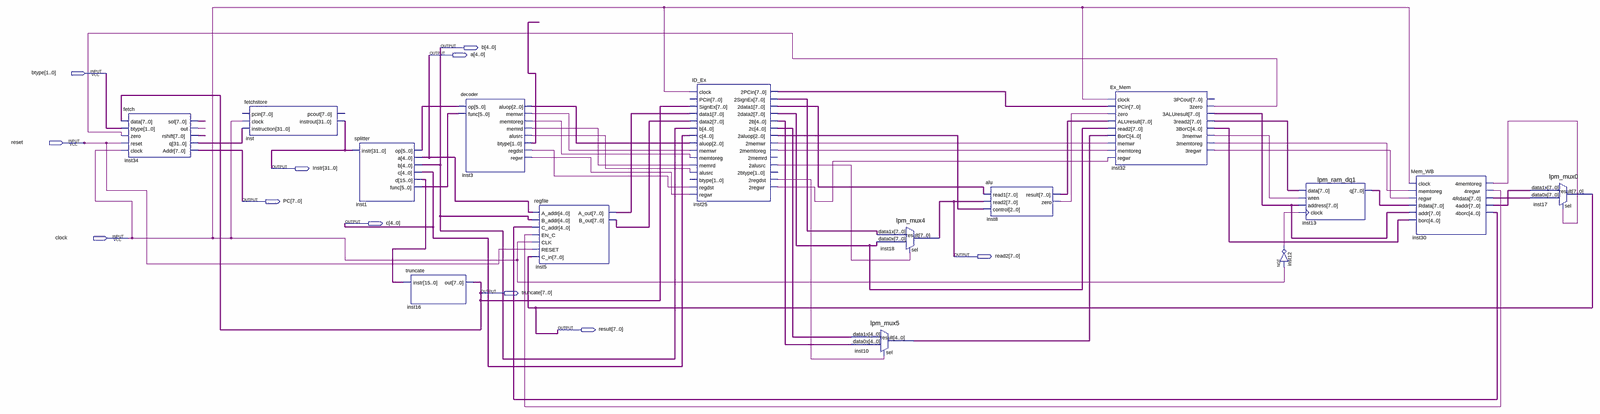
[diagram p0: schematic sheet, whole]
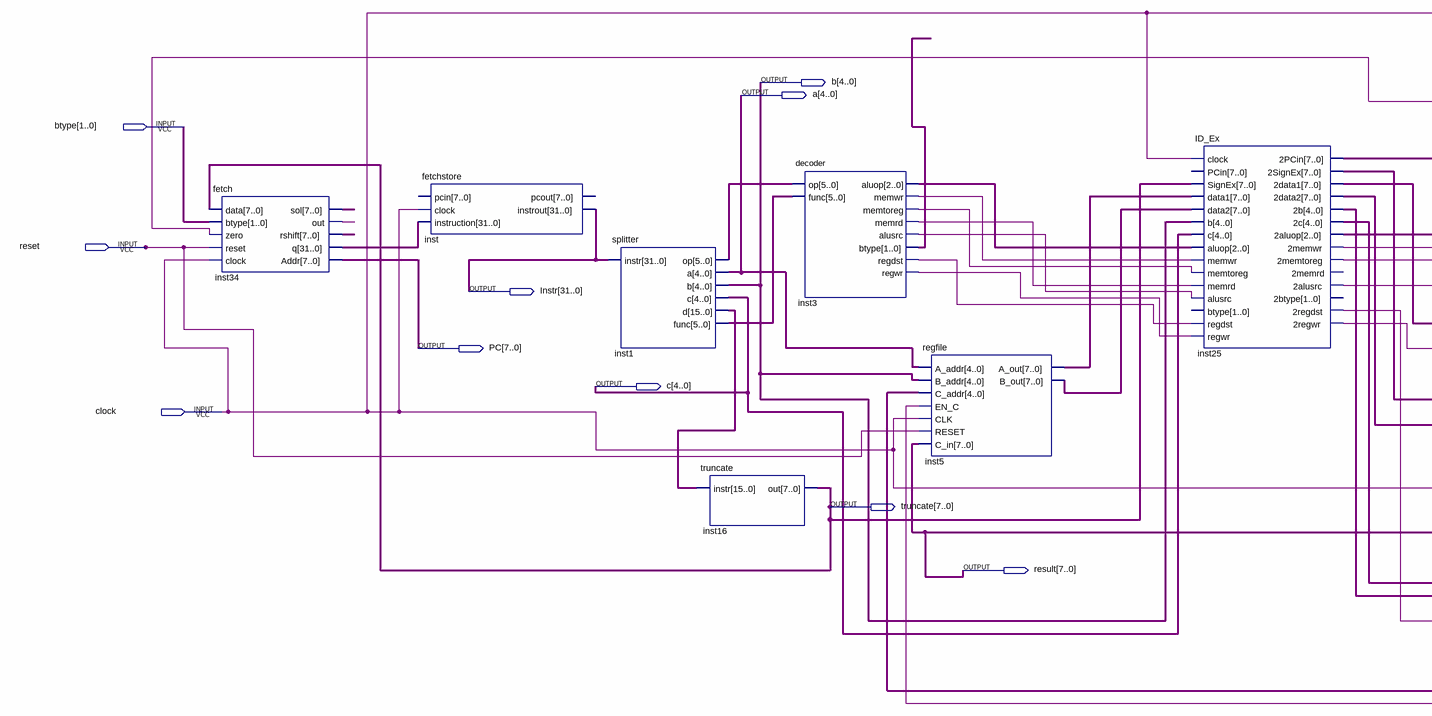
[diagram p1: schematic sheet, left part]
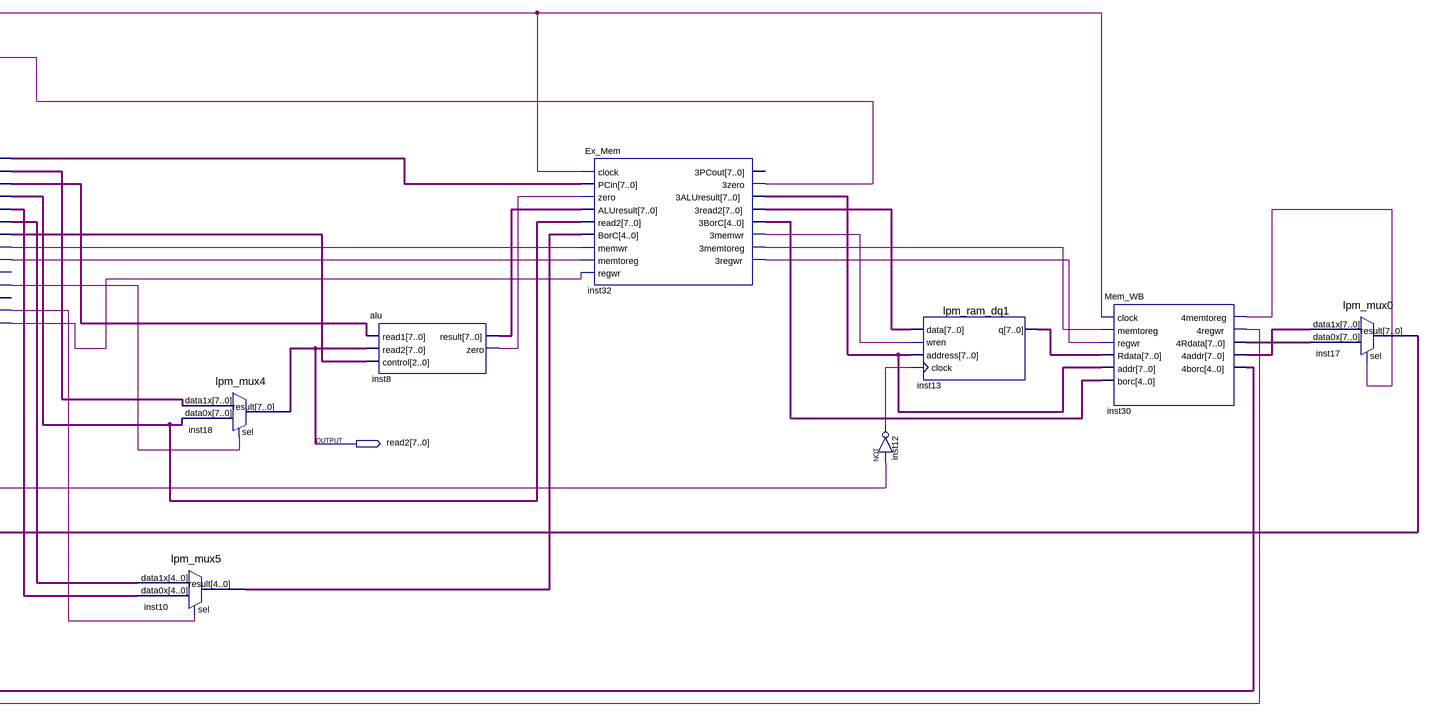
[diagram p2: schematic sheet, right part]
// Quartus schematic Project1.bdf as structural Verilog: 15 symbols, 11 pins
module Project1 (
  input  [1:0] btype,
  input  reset,
  input  clock,
  output [4:0] b,
  output [4:0] a,
  output [31:0] Instr,
  output [7:0] PC,
  output [4:0] c,
  output [7:0] read2,
  output [7:0] truncate,
  output [7:0] result
);

  wire inst3_alusrc, inst3_memrd, inst3_memtoreg, inst3_memwr, inst3_regdst, inst3_regwr, inst8_zero,
       inst12_out, inst25_2alusrc, inst25_2memtoreg, inst25_2memwr, inst25_2regdst, inst25_2regwr,
       inst30_4memtoreg, inst30_4regwr, inst32_3memtoreg, inst32_3memwr, inst32_3regwr, inst32_3zero,
       inst34_out;
  wire [1:0] inst3_btype;
  wire [2:0] inst3_aluop, inst25_2aluop;
  wire [4:0] inst10_result, inst25_2b, inst25_2c, inst30_4borc, inst32_3borc;
  wire [5:0] inst1_func, inst1_op;
  wire [7:0] inst5_a_out, inst5_b_out, inst8_result, inst13_q, inst25_2data1, inst25_2data2, inst25_2pcin,
       inst25_2signex, inst30_4addr, inst30_4rdata, inst32_3aluresult, inst32_3read2, inst34_rshift,
       inst34_sol;
  wire [15:0] inst1_d;
  wire [31:0] inst34_q;

  fetch inst34 (
    .data(truncate), .btype(btype), .zero(inst32_3zero), .reset(reset), .clock(clock), .sol(inst34_sol),
    .out(inst34_out), .rshift(inst34_rshift), .q(inst34_q), .Addr(PC));
  fetchstore inst (.clock(clock), .instruction(inst34_q), .instrout(Instr));  // open: pcin, pcout
  splitter inst1 (.instr(Instr), .op(inst1_op), .a(a), .b(b), .c(c), .d(inst1_d), .func(inst1_func));
  truncate inst16 (.instr(inst1_d), .out(truncate));
  decoder inst3 (
    .op(inst1_op), .func(inst1_func), .aluop(inst3_aluop), .memwr(inst3_memwr), .memtoreg(inst3_memtoreg),
    .memrd(inst3_memrd), .alusrc(inst3_alusrc), .btype(inst3_btype), .regdst(inst3_regdst),
    .regwr(inst3_regwr));
  regfile inst5 (
    .A_addr(a), .B_addr(b), .C_addr(inst30_4borc), .EN_C(inst30_4regwr), .CLK(clock), .RESET(reset),
    .C_in(result), .A_out(inst5_a_out), .B_out(inst5_b_out));
  ID_Ex inst25 (
    .clock(clock), .SignEx(truncate), .data1(inst5_a_out), .data2(inst5_b_out), .b(b), .c(c),
    .aluop(inst3_aluop), .memwr(inst3_memwr), .memtoreg(inst3_memtoreg), .memrd(inst3_memrd),
    .alusrc(inst3_alusrc), .regdst(inst3_regdst), .regwr(inst3_regwr), .\2PCin (inst25_2pcin),
    .\2SignEx (inst25_2signex), .\2data1 (inst25_2data1), .\2data2 (inst25_2data2), .\2b (inst25_2b),
    .\2c (inst25_2c), .\2aluop (inst25_2aluop), .\2memwr (inst25_2memwr), .\2memtoreg (inst25_2memtoreg),
    .\2alusrc (inst25_2alusrc), .\2regdst (inst25_2regdst), .\2regwr (inst25_2regwr));  // open: PCin, btype, 2memrd, 2btype
  lpm_mux5 inst10 (.data1x(inst25_2c), .data0x(inst25_2b), .sel(inst25_2regdst), .result(inst10_result));
  lpm_mux4 inst18 (.data1x(inst25_2signex), .data0x(inst25_2data2), .sel(inst25_2alusrc), .result(read2));
  alu inst8 (.read1(inst25_2data1), .read2(read2), .control(inst25_2aluop), .result(inst8_result), .zero(inst8_zero));
  Ex_Mem inst32 (
    .clock(clock), .PCin(inst25_2pcin), .zero(inst8_zero), .ALUresult(inst8_result), .read2(inst25_2data2),
    .BorC(inst10_result), .memwr(inst25_2memwr), .memtoreg(inst25_2memtoreg), .regwr(inst25_2regwr),
    .\3zero (inst32_3zero), .\3ALUresult (inst32_3aluresult), .\3read2 (inst32_3read2),
    .\3BorC (inst32_3borc), .\3memwr (inst32_3memwr), .\3memtoreg (inst32_3memtoreg), .\3regwr (inst32_3regwr));  // open: 3PCout
  not inst12 (inst12_out, clock);
  lpm_ram_dq1 inst13 (
    .data(inst32_3read2), .wren(inst32_3memwr), .address(inst32_3aluresult), .clock(inst12_out), .q(inst13_q));
  Mem_WB inst30 (
    .clock(clock), .memtoreg(inst32_3memtoreg), .regwr(inst32_3regwr), .Rdata(inst13_q),
    .addr(inst32_3aluresult), .borc(inst32_3borc), .\4memtoreg (inst30_4memtoreg), .\4regwr (inst30_4regwr),
    .\4Rdata (inst30_4rdata), .\4addr (inst30_4addr), .\4borc (inst30_4borc));
  lpm_mux0 inst17 (.data1x(inst30_4addr), .data0x(inst30_4rdata), .sel(inst30_4memtoreg), .result(result));
endmodule
